# Altium schematic sheet 6_mpu6050.SchDoc
size A
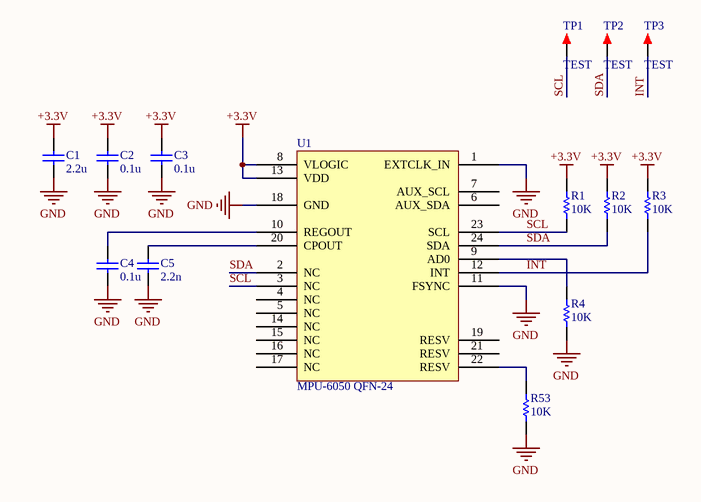
[diagram p0: 6_mpu6050.SchDoc]

## Parts
C1  2.2u  [CAP_0603_SMD]
C2  0.1u  [CAP_0603_SMD]
C3  0.1u  [CAP_0603_SMD]
C4  0.1u  [CAP_0603_SMD]
C5  2.2n  [CAP_0603_SMD]
R1  10K  [RES_0603_SMD]
R2  10K  [RES_0603_SMD]
R3  10K  [RES_0603_SMD]
R4  10K  [RES_0603_SMD]
R53  10K  [RES_0603_SMD]
TP1  TEST  [TEST 1.2]
TP2  TEST  [TEST 1.2]
TP3  TEST  [TEST 1.2]
U1  MPU-6050 QFN-24  [IC_QFN-24_4x4_NoExposedPad]

## Nets
+3.3V: C1.2 C2.2 C3.2 R1.2 R2.2 R3.2 U1.8(VLOGIC) U1.13(VDD)
GND: C1.1 C2.1 C3.1 C4.2 C5.2 R4.1 R53.1 U1.1(EXTCLK_IN) U1.11(FSYNC) U1.18(GND)
INT: R3.1 TP3.1 U1.12(INT)
SCL: R1.1 TP1.1 U1.3(NC) U1.23(SCL)
SDA: R2.1 TP2.1 U1.2(NC) U1.24(SDA)
NetC4_1: C4.1 U1.10(REGOUT)
NetC5_1: C5.1 U1.20(CPOUT)
NetR4_2: R4.2 U1.9(AD0)
NetR53_2: R53.2 U1.22(RESV)

Not connected (* = marked no-connect by the designer): U1 4(NC) 5(NC) 6(AUX_SDA) 7(AUX_SCL) 14(NC) 15(NC) 16(NC) 17(NC) 19(RESV) 21(RESV)

## Library data of the parts
C1-C5 = CAP_0603_SMD: Capacitor, 0603, SMD; Published: 8-Jun-2000; LatestRevisionDate: 17-Jul-2002; LatestRevisionNote: Re-released for DXP Platform.; PackageReference: RAD-0.3; Publisher: Altium Limited
R1-R4 R53 = RES_0603_SMD: Resistor, 0603, SMD; Published: 8-Jun-2000; LatestRevisionDate: 17-Jul-2002; LatestRevisionNote: Re-released for DXP Platform.; PackageReference: AXIAL-0.3; Publisher: Altium Limited; Value: Value
TP1-TP3 = TEST: 测试点; 联系卖家，免费查找封装: 唯一出售店铺网址https://shop463601444.taobao.com; BOM名称: 测试点
U1 = MPU-6050 QFN24 4x4: Triple Axis Accelerometer and Gyro